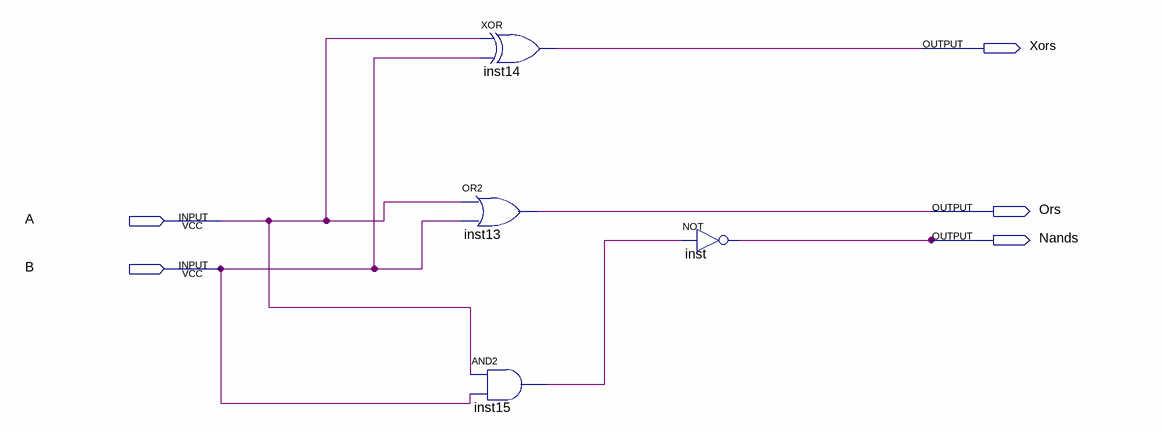
[diagram p0: schematic sheet]
// Quartus schematic compuertas2.bdf as structural Verilog: 4 symbols, 5 pins
module compuertas2 (
  input  A,
  input  B,
  output Xors,
  output Ors,
  output Nands
);

  wire inst15_out;

  xor inst14 (Xors, A, B);
  or inst13 (Ors, A, B);
  and inst15 (inst15_out, A, B);
  not inst (Nands, inst15_out);
endmodule
